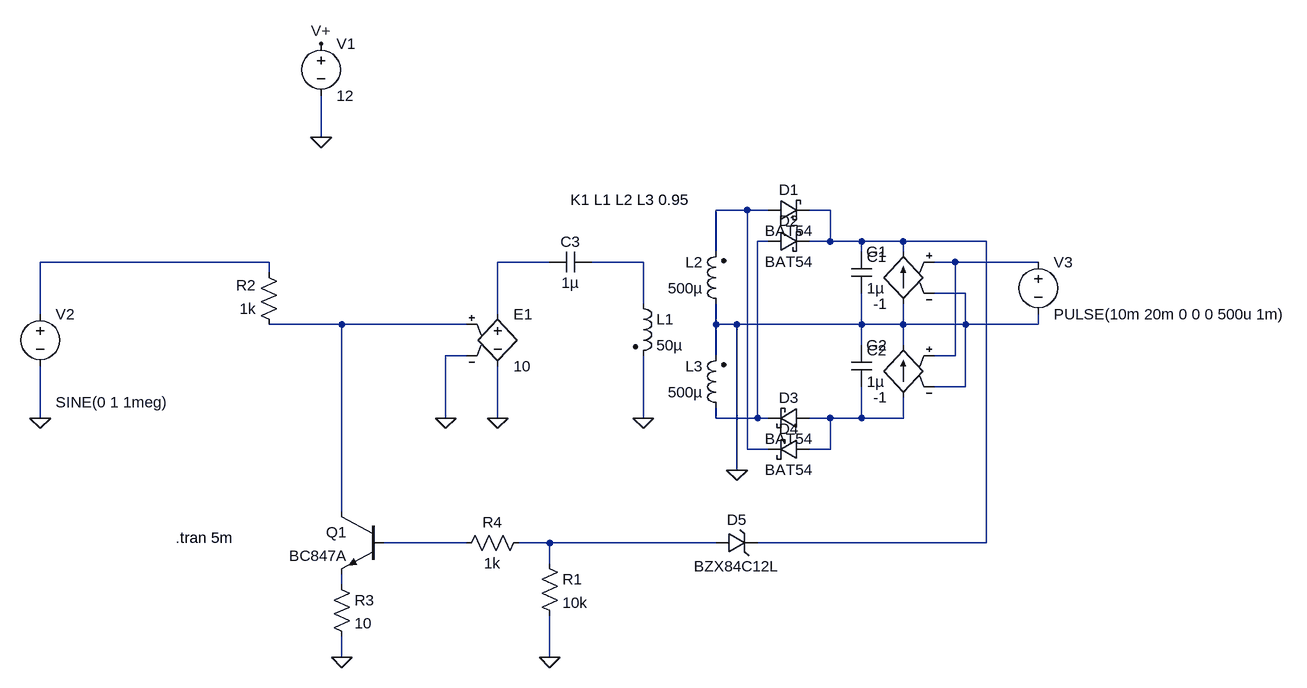
[diagram p0: schematic psu_sim.asc]
psu_sim.asc, the LTspice schematic file:
Version 4
SHEET 1 1268 680
WIRE -240 -176 -240 -240
WIRE 416 -64 368 -64
WIRE 448 -64 416 -64
WIRE 544 -64 512 -64
WIRE 448 -16 432 -16
WIRE 544 -16 544 -64
WIRE 544 -16 512 -16
WIRE 592 -16 544 -16
WIRE 656 -16 592 -16
WIRE 784 -16 656 -16
WIRE 368 0 368 -64
WIRE 592 0 592 -16
WIRE 656 0 656 -16
WIRE -320 16 -672 16
WIRE 112 16 32 16
WIRE 256 16 176 16
WIRE 736 16 704 16
WIRE 864 16 736 16
WIRE -320 32 -320 16
WIRE 752 64 704 64
WIRE 256 80 256 16
WIRE -672 96 -672 16
WIRE 32 96 32 16
WIRE -208 112 -320 112
WIRE -16 112 -208 112
WIRE 368 112 368 80
WIRE 400 112 368 112
WIRE 592 112 592 64
WIRE 592 112 400 112
WIRE 656 112 656 80
WIRE 656 112 592 112
WIRE 752 112 752 64
WIRE 752 112 656 112
WIRE 864 112 864 96
WIRE 864 112 752 112
WIRE 592 144 592 112
WIRE 656 144 656 112
WIRE -16 160 -48 160
WIRE 368 160 368 112
WIRE 736 160 736 16
WIRE 736 160 704 160
WIRE 752 208 752 112
WIRE 752 208 704 208
WIRE -672 256 -672 176
WIRE -48 256 -48 160
WIRE 32 256 32 176
WIRE 256 256 256 160
WIRE 368 256 368 240
WIRE 432 256 432 -16
WIRE 432 256 368 256
WIRE 448 256 432 256
WIRE 544 256 512 256
WIRE 592 256 592 208
WIRE 592 256 544 256
WIRE 656 256 656 224
WIRE 656 256 592 256
WIRE 416 304 416 -64
WIRE 448 304 416 304
WIRE 544 304 544 256
WIRE 544 304 512 304
WIRE 400 336 400 112
WIRE -208 400 -208 112
WIRE -16 448 -144 448
WIRE 112 448 64 448
WIRE 368 448 112 448
WIRE 784 448 784 -16
WIRE 784 448 432 448
WIRE 112 480 112 448
WIRE -208 512 -208 496
WIRE -208 624 -208 592
WIRE 112 624 112 560
FLAG -240 -320 V+
FLAG -240 -176 0
FLAG -672 256 0
FLAG 256 256 0
FLAG 400 336 0
FLAG -48 256 0
FLAG 32 256 0
FLAG 112 624 0
FLAG -208 624 0
SYMBOL voltage -240 -336 R0
WINDOW 123 0 0 Left 0
WINDOW 39 0 0 Left 0
SYMATTR InstName V1
SYMATTR Value 12
SYMBOL voltage -672 80 R0
WINDOW 3 24 152 Left 2
WINDOW 123 24 124 Left 2
WINDOW 39 0 0 Left 0
SYMATTR Value SINE(0 1 1meg)
SYMATTR InstName V2
SYMBOL ind2 240 64 R0
SYMATTR InstName L1
SYMATTR Value 50µ
SYMATTR Type ind
SYMBOL ind2 384 96 R180
WINDOW 0 36 80 Left 2
WINDOW 3 36 40 Left 2
SYMATTR InstName L2
SYMATTR Value 500µ
SYMATTR Type ind
SYMBOL ind2 384 256 R180
WINDOW 0 36 80 Left 2
WINDOW 3 36 40 Left 2
SYMATTR InstName L3
SYMATTR Value 500µ
SYMATTR Type ind
SYMBOL schottky 448 -48 R270
WINDOW 0 32 32 VTop 2
WINDOW 3 0 32 VBottom 2
SYMATTR InstName D1
SYMATTR Value BAT54
SYMATTR Description Diode
SYMATTR Type diode
SYMBOL schottky 448 0 R270
WINDOW 0 32 32 VTop 2
WINDOW 3 0 32 VBottom 2
SYMATTR InstName D2
SYMATTR Value BAT54
SYMATTR Description Diode
SYMATTR Type diode
SYMBOL schottky 512 240 R90
WINDOW 0 0 32 VBottom 2
WINDOW 3 32 32 VTop 2
SYMATTR InstName D3
SYMATTR Value BAT54
SYMATTR Description Diode
SYMATTR Type diode
SYMBOL schottky 512 288 R90
WINDOW 0 0 32 VBottom 2
WINDOW 3 32 32 VTop 2
SYMATTR InstName D4
SYMATTR Value BAT54
SYMATTR Description Diode
SYMATTR Type diode
SYMBOL cap 576 0 R0
SYMATTR InstName C1
SYMATTR Value 1µ
SYMBOL cap 576 144 R0
SYMATTR InstName C2
SYMATTR Value 1µ
SYMBOL cap 176 0 R90
WINDOW 0 0 32 VBottom 2
WINDOW 3 32 32 VTop 2
SYMATTR InstName C3
SYMATTR Value 1µ
SYMBOL e 32 80 R0
SYMATTR InstName E1
SYMATTR Value 10
SYMBOL res 80 432 R90
WINDOW 0 0 56 VBottom 2
WINDOW 3 32 56 VTop 2
SYMATTR InstName R4
SYMATTR Value 1k
SYMBOL voltage 864 0 R0
WINDOW 123 0 0 Left 0
WINDOW 39 0 0 Left 0
SYMATTR InstName V3
SYMATTR Value PULSE(10m 20m 0 0 0 500u 1m)
SYMBOL g 656 -16 M0
SYMATTR InstName G1
SYMATTR Value -1
SYMBOL g 656 128 M0
SYMATTR InstName G2
SYMATTR Value -1
SYMBOL zener 368 464 R270
WINDOW 0 36 32 VTop 2
WINDOW 3 -4 32 VBottom 2
SYMATTR InstName D5
SYMATTR Value BZX84C12L
SYMBOL res 96 464 R0
SYMATTR InstName R1
SYMATTR Value 10k
SYMBOL res -304 128 R180
WINDOW 0 36 76 Left 2
WINDOW 3 36 40 Left 2
SYMATTR InstName R2
SYMATTR Value 1k
SYMBOL npn -144 400 M0
SYMATTR InstName Q1
SYMATTR Value BC847A
SYMBOL res -224 496 R0
SYMATTR InstName R3
SYMATTR Value 10
TEXT -464 440 Left 2 !.tran 5m
TEXT 144 -80 Left 2 !K1 L1 L2 L3 0.95

The netlist it stands for:
* psu_sim.asc
V1 V+ 0 12
V2 N004 0 SINE(0 1 1meg)
L1 N006 0 50µ
L2 0 N001 500µ
L3 N003 0 500µ
D1 N001 N002 BAT54
D2 N003 N002 BAT54
D3 N009 N003 BAT54
D4 N009 N001 BAT54
C1 N002 0 1µ
C2 0 N009 1µ
C3 N006 N005 1µ
E1 N005 0 N008 0 10
R4 N011 N010 1k
V3 N007 0 PULSE(10m 20m 0 0 0 500u 1m)
G1 0 N002 N007 0 -1
G2 N009 0 N007 0 -1
D5 N011 N002 BZX84C12L
R1 N011 0 10k
R2 N008 N004 1k
Q1 N008 N010 N012 0 BC847A
R3 N012 0 10
.model D D
.lib standard.dio
.model NPN NPN
.model PNP PNP
.lib standard.bjt
.tran 5m
K1 L1 L2 L3 0.95
.backanno
.end